# Altium schematic sheet KEYBOARD.SchDoc
size A
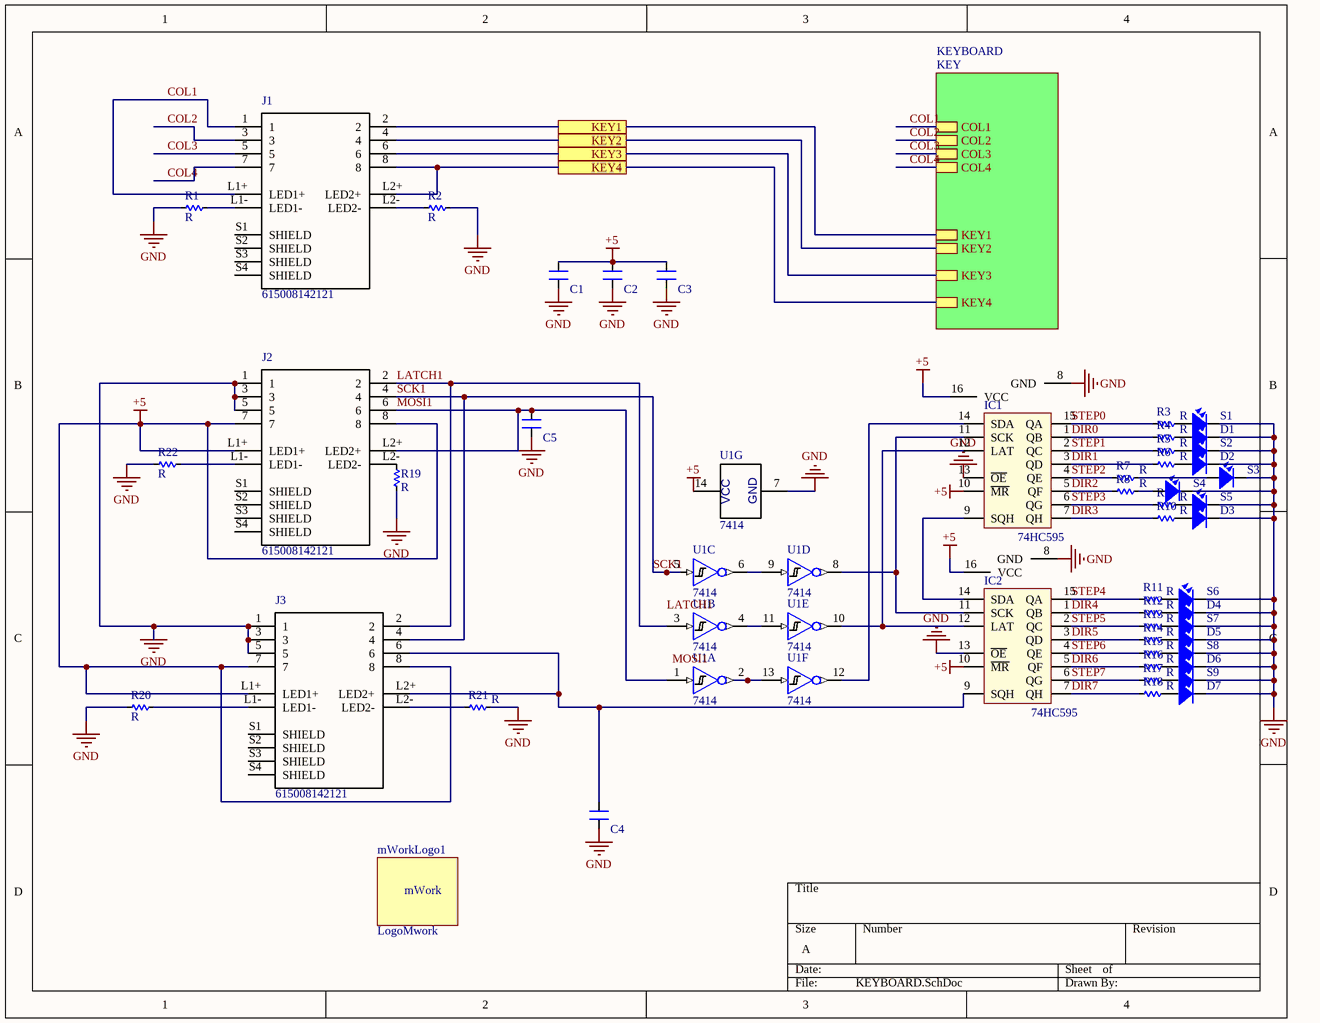
[diagram p0: KEYBOARD.SchDoc]

## Parts
C1  CN  [CN-SMD-0603_big]  (value not drawn)
C2  CN  [CN-SMD-0603_big]  (value not drawn)
C3  CN  [CN-SMD-0603_big]  (value not drawn)
C4  CN  [CN-SMD-0603_big]  (value not drawn)
C5  CN  [CN-SMD-0603_big]  (value not drawn)
D1  LED  [LED-0805-Blue]  (value not drawn)
D2  LED  [LED-0805-Blue]  (value not drawn)
D3  LED  [LED-0805-Blue]  (value not drawn)
D4  LED  [LED-0805-Blue]  (value not drawn)
D5  LED  [LED-0805-Blue]  (value not drawn)
D6  LED  [LED-0805-Blue]  (value not drawn)
D7  LED  [LED-0805-Blue]  (value not drawn)
IC1  74HC595  [SO16]
IC2  74HC595  [SO16]
J1  615008142121  [RJ45_8P8C]
J2  615008142121  [RJ45_8P8C]
J3  615008142121  [RJ45_8P8C]
mWorkLogo1  LogoMwork  [LogoMwork15*6]
R1  R  [RES-SMD-0603_BIG]
R2  R  [RES-SMD-0603_BIG]
R3  R  [RES-SMD-0603_BIG]
R4  R  [RES-SMD-0603_BIG]
R5  R  [RES-SMD-0603_BIG]
R6  R  [RES-SMD-0603_BIG]
R7  R  [RES-SMD-0603_BIG]
R8  R  [RES-SMD-0603_BIG]
R9  R  [RES-SMD-0603_BIG]
R10  R  [RES-SMD-0603_BIG]
R11  R  [RES-SMD-0603_BIG]
R12  R  [RES-SMD-0603_BIG]
R13  R  [RES-SMD-0603_BIG]
R14  R  [RES-SMD-0603_BIG]
R15  R  [RES-SMD-0603_BIG]
R16  R  [RES-SMD-0603_BIG]
R17  R  [RES-SMD-0603_BIG]
R18  R  [RES-SMD-0603_BIG]
R19  R  [RES-SMD-0603_BIG]
R20  R  [RES-SMD-0603_BIG]
R21  R  [RES-SMD-0603_BIG]
R22  R  [RES-SMD-0603_BIG]
S1  LED  [LED-0805-Blue]  (value not drawn)
S2  LED  [LED-0805-Blue]  (value not drawn)
S3  LED  [LED-0805-Blue]  (value not drawn)
S4  LED  [LED-0805-Blue]  (value not drawn)
S5  LED  [LED-0805-Blue]  (value not drawn)
S6  LED  [LED-0805-Blue]  (value not drawn)
S7  LED  [LED-0805-Blue]  (value not drawn)
S8  LED  [LED-0805-Blue]  (value not drawn)
S9  LED  [LED-0805-Blue]  (value not drawn)
U1  7414  [SO14]  (parts A,B,C,D,E,F,G of 7)

## Sub-sheets
KEYBOARD = KEY: COL1, COL2, COL3, COL4, KEY2, KEY1, KEY3, KEY4

## Ports
KEY1, KEY2, KEY3, KEY4

## Nets
+5: C1.2 C2.2 C3.2 IC1.10(~{MR}) IC1.16(VCC) IC2.10(~{MR}) IC2.16(VCC) J2.7 J2.8 J2.L1+(LED1+) J3.7 J3.8 J3.L1+(LED1+) U1.14(VCC)  [also labelled VCC]
GND: C1.1 C2.1 C3.1 C4.1 C5.1 D1.2 D2.2 D3.2 D4.2 D5.2 D6.2 D7.2 IC1.8(GND) IC1.13(~{OE}) IC2.8(GND) IC2.13(~{OE}) J2.1 J2.3 J2.5 J3.1 J3.3 J3.5 R1.2 R2.1 R19.1 R20.2 R21.2 R22.2 S1.2 S2.2 S3.2 S4.2 S5.2 S6.2 S7.2 S8.2 S9.2 U1.7(GND)
COL1: J1.1 J1.L1+(LED1+) ; sheet KEYBOARD/COL1
COL2: J1.3 ; sheet KEYBOARD/COL2
COL3: J1.5 ; sheet KEYBOARD/COL3
COL4: J1.7 ; sheet KEYBOARD/COL4
DIR0: IC1.1(QB) R4.1
DIR1: IC1.3(QD) R6.1
DIR2: IC1.5(QF) R8.1
DIR3: IC1.7(QH) R10.1
DIR4: IC2.1(QB) R12.1
DIR5: IC2.3(QD) R14.1
DIR6: IC2.5(QF) R16.1
DIR7: IC2.7(QH) R18.1
KEY1: J1.2 ; port KEY1, sheet KEYBOARD/KEY1
KEY2: J1.4 ; port KEY2, sheet KEYBOARD/KEY2
KEY3: J1.6 ; port KEY3, sheet KEYBOARD/KEY3
KEY4: J1.8 J1.L2+(LED2+) ; port KEY4, sheet KEYBOARD/KEY4
LATCH1: J2.2 J3.2 U1.3(A)
MOSI1: C5.2 J2.6 J2.L2+(LED2+) U1.1(A)
SCK1: J2.4 J3.4 U1.5(A)
STEP0: IC1.15(QA) R3.1
STEP1: IC1.2(QC) R5.1
STEP2: IC1.4(QE) R7.1
STEP3: IC1.6(QG) R9.1
STEP4: IC2.15(QA) R11.1
STEP5: IC2.2(QC) R13.1
STEP6: IC2.4(QE) R15.1
STEP7: IC2.6(QG) R17.1
NetC4_2: C4.2 IC2.9(SQH) J3.6 J3.L2+(LED2+)
NetD1_1: D1.1 R4.2
NetD2_1: D2.1 R6.2
NetD3_1: D3.1 R10.2
NetD4_1: D4.1 R12.2
NetD5_1: D5.1 R14.2
NetD6_1: D6.1 R16.2
NetD7_1: D7.1 R18.2
NetIC1_9: IC1.9(SQH) IC2.14(SDA)
NetIC1_11: IC1.11(SCK) IC2.11(SCK) U1.8(Y)
NetIC1_12: IC1.12(LAT) IC2.12(LAT) U1.10(Y)
NetIC1_14: IC1.14(SDA) U1.12(Y)
NetJ1_L1-: J1.L1-(LED1-) R1.1
NetJ1_L2-: J1.L2-(LED2-) R2.2
NetJ2_L1-: J2.L1-(LED1-) R22.1
NetJ2_L2-: J2.L2-(LED2-) R19.2
NetJ3_L1-: J3.L1-(LED1-) R20.1
NetJ3_L2-: J3.L2-(LED2-) R21.1
NetR3_2: R3.2 S1.1
NetR5_2: R5.2 S2.1
NetR7_2: R7.2 S3.1
NetR8_2: R8.2 S4.1
NetR9_2: R9.2 S5.1
NetR11_2: R11.2 S6.1
NetR13_2: R13.2 S7.1
NetR15_2: R15.2 S8.1
NetR17_2: R17.2 S9.1
NetU1_2: U1.2(Y) U1.13(A)
NetU1_4: U1.4(Y) U1.11(A)
NetU1_6: U1.6(Y) U1.9(A)

Not connected (* = marked no-connect by the designer): J1 S1(SHIELD) S2(SHIELD) S3(SHIELD) S4(SHIELD); J2 S1(SHIELD) S2(SHIELD) S3(SHIELD) S4(SHIELD); J3 S1(SHIELD) S2(SHIELD) S3(SHIELD) S4(SHIELD)

## Notes on the sheet
- Labels drawn without touching a wire or pin: LATCH1, MOSI1
- (in symbol LogoMwork) mWork

## Library data of the parts
C1-C5 = CN: Value: 33pF
D1-D7 S1-S9 = LED SMD: Value: LED 3 - 5 ly 2 Colour
IC1 IC2 = 74595: 8 Bit Serial input - Parallel Output; Value: 74HC595
J1-J3 = RJ45_8P8C: Conn, Rj45 Jack, Shld, 1port, 8p8c, Cat5; MF: WÃ¼rth Elektronik; MP: 615008142121; Price: None; Availability: Unavailable; SnapEDA_Link: https://www.snapeda.com/parts/615008142121/W%C3%BCrth%20Elektronik/view-part/1118273/?ref=snap; Package: None; Value: *
U1 = 7414: IC, M74HC04M, Hex Inverter, SO-14; Text Field1: ST; Text Field2: M74HC04M1R; Text Field3: Mouser; Text Field4: 511-M74HC04M; Text Field6: .22; Text Field5: SO-14; NI?: *; O?: *; Section:: *